# Altium schematic sheet Sheet3.SchDoc
size A4
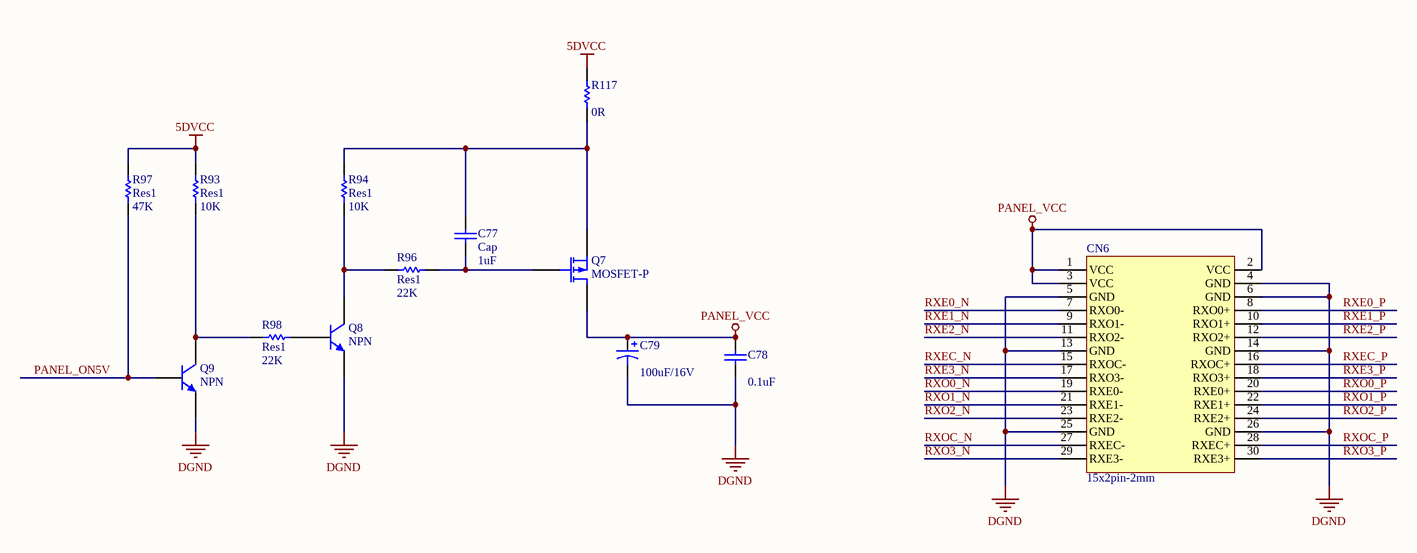
[diagram p0: Sheet3.SchDoc]

## Parts
C77  Cap  value 1uF  [C-0402]
C78  value 0.1uF  [C-0402]  (hidden comment: Cap)
C79  value 100uF/16V  [CE-D3.6]  (hidden comment: Cap Pol1)
CN6  15x2pin-2mm  [JP-2*15]
Q7  MOSFET-P  [Q-SOT23]
Q8  NPN  [Q-SOT23]
Q9  NPN  [Q-SOT23]
R93  Res1  value 10K  [R-0603]
R94  Res1  value 10K  [R-0603]
R96  Res1  value 22K  [R-0603]
R97  Res1  value 47K  [R-0603]
R98  Res1  value 22K  [R-0603]
R117  value 0R  [R-0805]  (hidden comment: Res1)

## Nets
5DVCC: R93.2 R97.2 R117.1
DGND: C78.2 C79.2 CN6.4(GND) CN6.5(GND) CN6.6(GND) CN6.13(GND) CN6.14(GND) CN6.25(GND) CN6.26(GND) Q8.3(E) Q9.3(E)
PANEL_VCC: C78.1 C79.1 CN6.1(VCC) CN6.2(VCC) CN6.3(VCC) Q7.1(D)
PANEL_ON5V: Q9.2(B) R97.1
RXE0_N: CN6.7(RXO0-)
RXE0_P: CN6.8(RXO0+)
RXE1_N: CN6.9(RXO1-)
RXE1_P: CN6.10(RXO1+)
RXE2_N: CN6.11(RXO2-)
RXE2_P: CN6.12(RXO2+)
RXE3_N: CN6.17(RXO3-)
RXE3_P: CN6.18(RXO3+)
RXEC_N: CN6.15(RXOC-)
RXEC_P: CN6.16(RXOC+)
RXO0_N: CN6.19(RXE0-)
RXO0_P: CN6.20(RXE0+)
RXO1_N: CN6.21(RXE1-)
RXO1_P: CN6.22(RXE1+)
RXO2_N: CN6.23(RXE2-)
RXO2_P: CN6.24(RXE2+)
RXO3_N: CN6.29(RXE3-)
RXO3_P: CN6.30(RXE3+)
RXOC_N: CN6.27(RXEC-)
RXOC_P: CN6.28(RXEC+)
NetC77_1: C77.1 Q7.3(S) R94.1 R117.2
NetC77_2: C77.2 Q7.2(G) R96.1
NetQ8_1: Q8.1(C) R94.2 R96.2
NetQ8_2: Q8.2(B) R98.1
NetQ9_1: Q9.1(C) R93.1 R98.2

## Library data of the parts
C77 C78 = Cap: Capacitor; Published: 8-Jun-2000; LatestRevisionDate: 17-Jul-2002; LatestRevisionNote: Re-released for DXP Platform.; PackageReference: RAD-0.3; Publisher: Altium Limited; PackageDescription: Radial Cap, Thru-Hole; 2 Leads; 0.3 in Pin Spacing
C79 = Cap Pol1: Polarized Capacitor (Radial); Published: 8-Jun-2000; LatestRevisionDate: 17-Jul-2002; LatestRevisionNote: Re-released for DXP Platform.; PackageReference: RB7.6-15; Publisher: Altium Limited; PackageDescription: Polarized Capacitor (Radial); 2 Leads
Q7 = MOSFET-P: P-Channel MOSFET; Published: 8-Jun-2000; LatestRevisionDate: 17-Jul-2002; LatestRevisionNote: Re-released for DXP Platform.; PackageVersion: 1995/1996; PackageReference: E3; Publisher: Altium Limited; PackageDescription: TO, Flat Index; 3 In-Line, Axial Leads; Body Dia. 4.6mm; Lead Dia. 0.5 mm (max)
Q8 Q9 = NPN: NPN Bipolar Transistor; Published: 8-Jun-2000; LatestRevisionDate: 17-Jul-2002; LatestRevisionNote: Re-released for DXP Platform.; PackageReference: TO-226-AA; Publisher: Altium Limited; PackageDescription: TO, Flat Index; 3 In-Line, Axial Leads; Body Dia. 4.8mm; Leads 0.55 x 0.51 mm (max); Code_JEDEC: TO-226-AA
R93 R94 R96-R98 R117 = Res1: Resistor; Published: 8-Jun-2000; LatestRevisionDate: 17-Jul-2002; LatestRevisionNote: Re-released for DXP Platform.; PackageReference: AXIAL-0.3; Publisher: Altium Limited; PackageDescription: Axial Device, Thru-Hole; 2 Leads; 0.3 in Pin Spacing